# Altium schematic sheet Test_SEAx.SchDoc
size A3
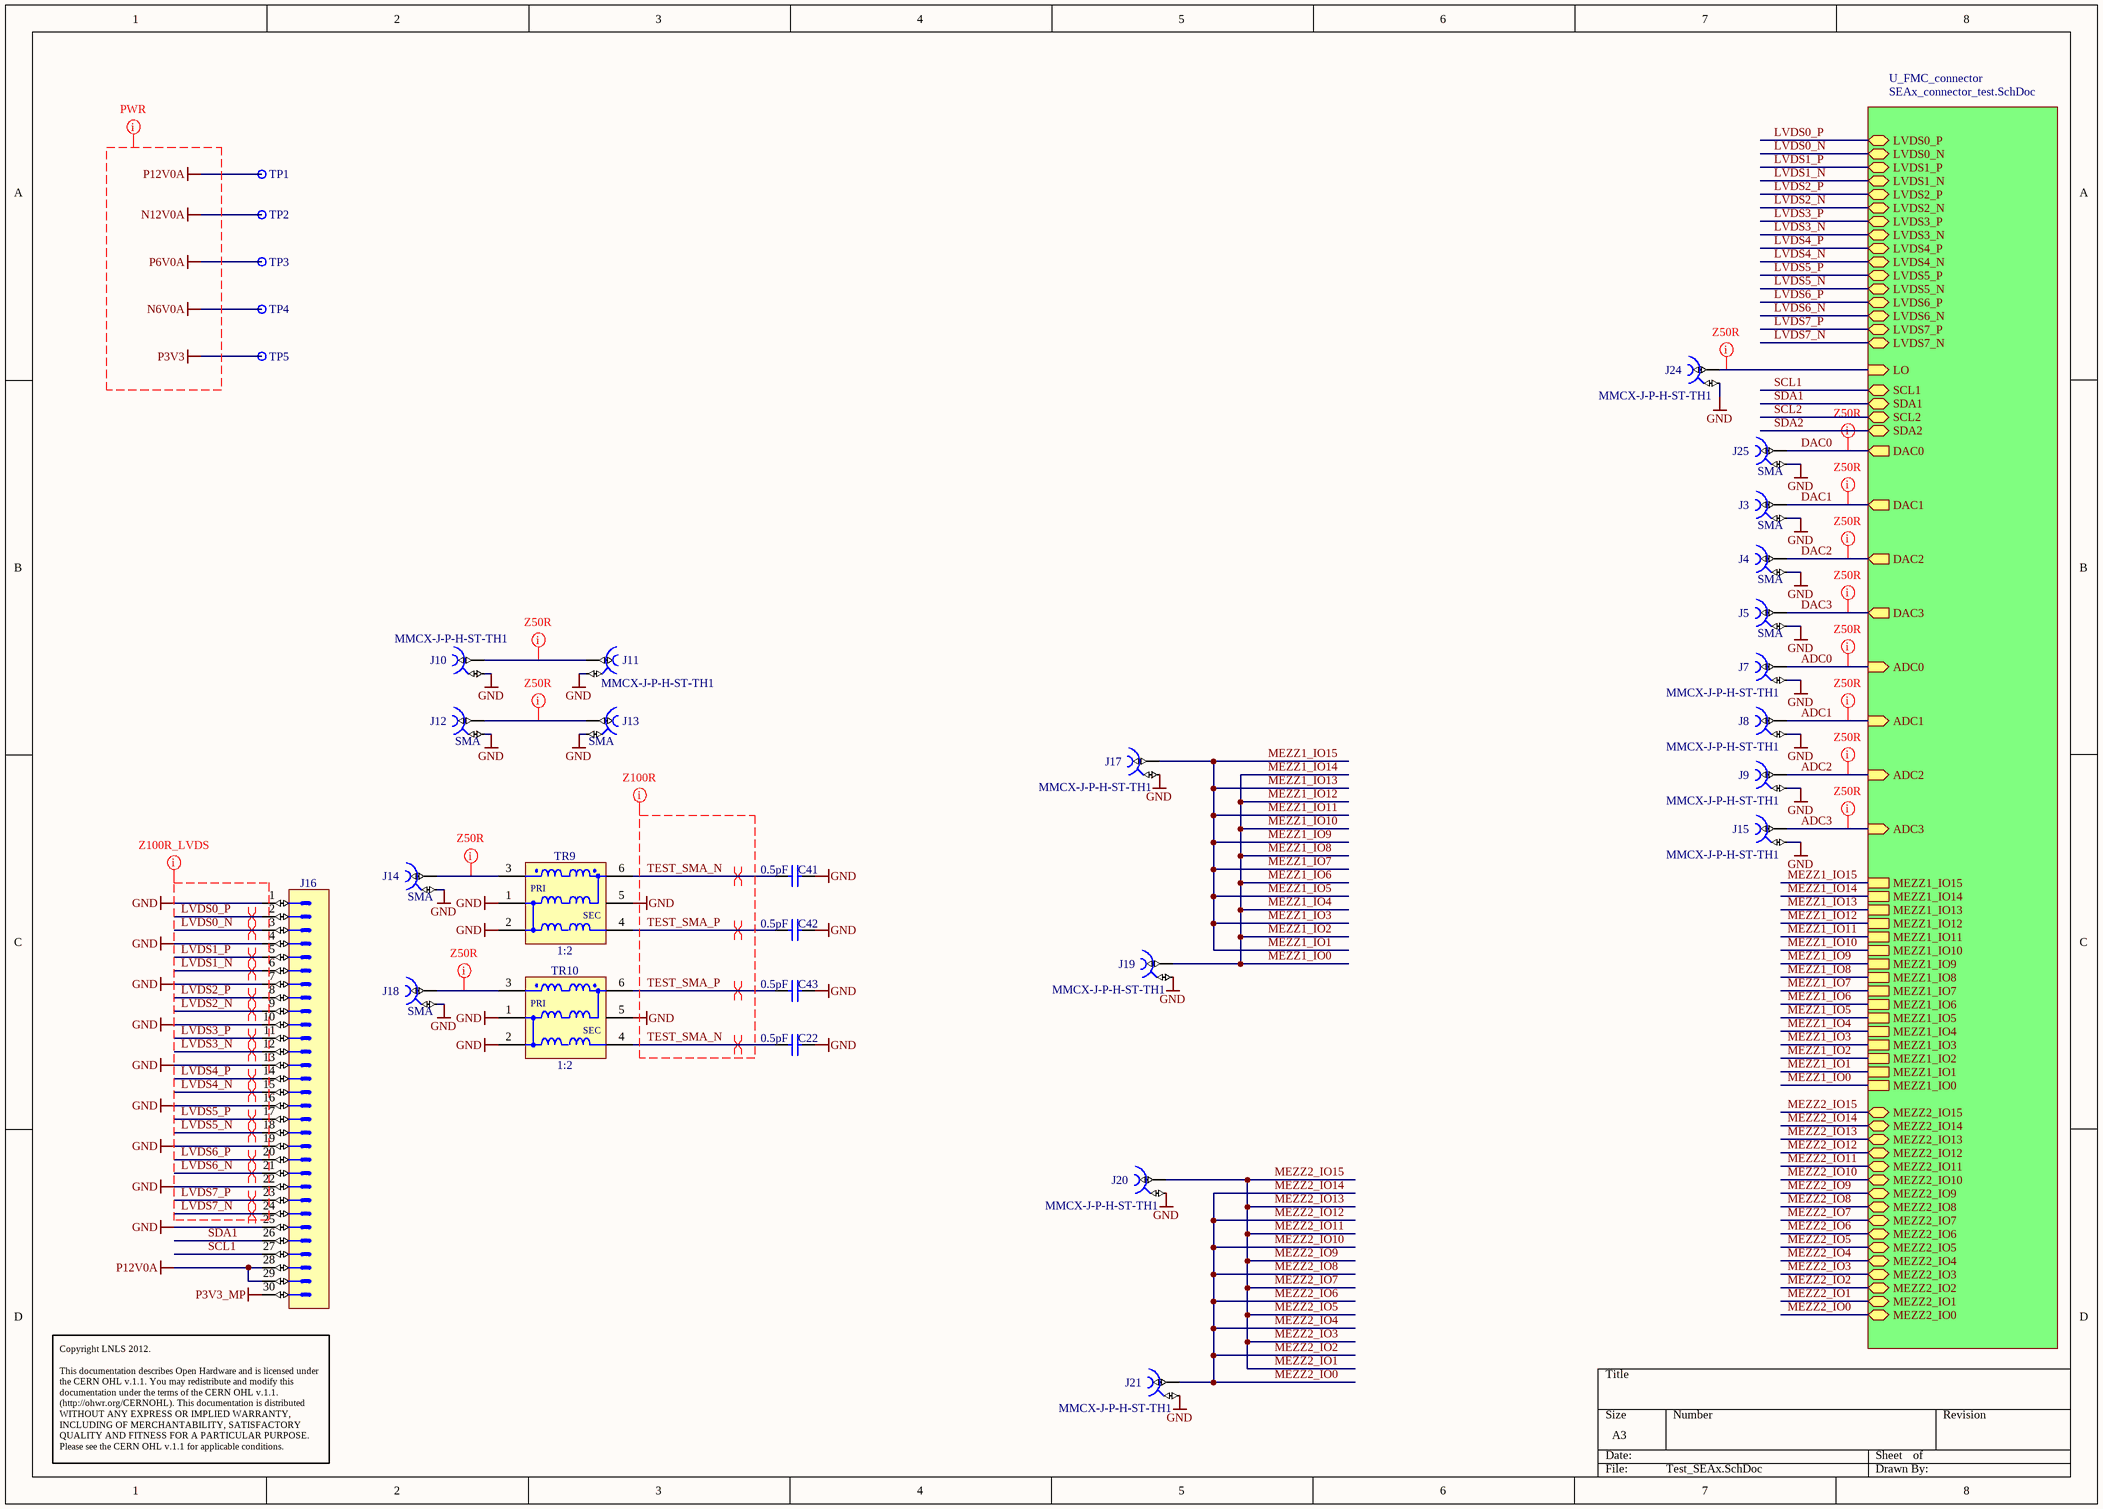
[diagram p0: Test_SEAx.SchDoc]

## Parts
C22  0.5pF  [CAPC1005X50N]
C41  0.5pF  [CAPC1005X50N]
C42  0.5pF  [CAPC1005X50N]
C43  0.5pF  [CAPC1005X50N]
J3  SMA  [TYCO_5-1814832-1]
J4  SMA  [TYCO_5-1814832-1]
J5  SMA  [TYCO_5-1814832-1]
J7  Manufacturer Part Number: MMCX-J-P-H-ST-TH1  [SAMTEC_MMCX-J-P-H-ST-TH1]  (hidden comment: Coax_1Female_1Shield)
J8  Manufacturer Part Number: MMCX-J-P-H-ST-TH1  [SAMTEC_MMCX-J-P-H-ST-TH1]  (hidden comment: Coax_1Female_1Shield)
J9  Manufacturer Part Number: MMCX-J-P-H-ST-TH1  [SAMTEC_MMCX-J-P-H-ST-TH1]  (hidden comment: Coax_1Female_1Shield)
J10  Manufacturer Part Number: MMCX-J-P-H-ST-TH1  [SAMTEC_MMCX-J-P-H-ST-TH1]  (hidden comment: Coax_1Female_1Shield)
J11  Manufacturer Part Number: MMCX-J-P-H-ST-TH1  [SAMTEC_MMCX-J-P-H-ST-TH1]  (hidden comment: Coax_1Female_1Shield)
J12  SMA  [TYCO_5-1814832-1]
J13  SMA  [TYCO_5-1814832-1]
J14  SMA  [TYCO_5-1814832-1]
J15  Manufacturer Part Number: MMCX-J-P-H-ST-TH1  [SAMTEC_MMCX-J-P-H-ST-TH1]  (hidden comment: Coax_1Female_1Shield)
J16  (no value)  [3M_N2530-6002RB]
J17  Manufacturer Part Number: MMCX-J-P-H-ST-TH1  [SAMTEC_MMCX-J-P-H-ST-TH1]  (hidden comment: Coax_1Female_1Shield)
J18  SMA  [TYCO_5-1814832-1]
J19  Manufacturer Part Number: MMCX-J-P-H-ST-TH1  [SAMTEC_MMCX-J-P-H-ST-TH1]  (hidden comment: Coax_1Female_1Shield)
J20  Manufacturer Part Number: MMCX-J-P-H-ST-TH1  [SAMTEC_MMCX-J-P-H-ST-TH1]  (hidden comment: Coax_1Female_1Shield)
J21  Manufacturer Part Number: MMCX-J-P-H-ST-TH1  [SAMTEC_MMCX-J-P-H-ST-TH1]  (hidden comment: Coax_1Female_1Shield)
J24  Manufacturer Part Number: MMCX-J-P-H-ST-TH1  [SAMTEC_MMCX-J-P-H-ST-TH1]  (hidden comment: Coax_1Female_1Shield)
J25  SMA  [TYCO_5-1814832-1]
TP1  Test Point  [TPS127]  (value not drawn)
TP2  Test Point  [TPS127]  (value not drawn)
TP3  Test Point  [TPS127]  (value not drawn)
TP4  Test Point  [TPS127]  (value not drawn)
TP5  Test Point  [TPS127]  (value not drawn)
TR9  1:2  [XFMR_MINI-CIRCUITS_DB1627]
TR10  1:2  [XFMR_MINI-CIRCUITS_DB1627]

## Sub-sheets
U_FMC_connector = SEAx_connector_test.SchDoc: ADC0 (in), ADC3 (in), ADC2 (in), ADC1 (in), MEZZ2_IO15 (bidir), MEZZ2_IO14 (bidir), MEZZ2_IO13 (bidir), MEZZ2_IO12 (bidir), MEZZ2_IO11 (bidir), MEZZ2_IO10 (bidir), MEZZ2_IO9 (bidir), MEZZ2_IO8 (bidir), MEZZ2_IO7 (bidir), MEZZ2_IO6 (bidir), MEZZ2_IO5 (bidir), MEZZ2_IO4 (bidir), MEZZ2_IO3 (bidir), MEZZ2_IO2 (bidir), MEZZ2_IO1 (bidir), MEZZ2_IO0 (bidir), MEZZ1_IO15, MEZZ1_IO14, MEZZ1_IO13, MEZZ1_IO12, MEZZ1_IO11, MEZZ1_IO10, MEZZ1_IO9, MEZZ1_IO8, MEZZ1_IO7, MEZZ1_IO6, MEZZ1_IO5, MEZZ1_IO4, MEZZ1_IO3, MEZZ1_IO2, MEZZ1_IO1, MEZZ1_IO0, SCL1 (bidir), SDA1 (bidir), SCL2 (bidir), SDA2 (bidir), LVDS0_P (bidir), LVDS0_N (bidir), LVDS1_P (bidir), LVDS1_N (bidir), LVDS2_P (bidir), LVDS2_N (bidir), LVDS3_P (bidir), LVDS3_N (bidir), LVDS4_P (bidir), LVDS4_N (bidir), LVDS5_P (bidir), LVDS5_N (bidir), LVDS6_P (bidir), LVDS6_N (bidir), LVDS7_P (bidir), LVDS7_N (bidir), LO (in), DAC0 (out), DAC3 (out), DAC2 (out), DAC1 (out)

## Nets
GND: C22.2 C41.2 C42.2 C43.2 J3.2 J4.2 J5.2 J7.2 J8.2 J9.2 J10.2 J11.2 J12.2 J13.2 J14.2 J15.2 J16.1 J16.4 J16.7 J16.10 J16.13 J16.16 J16.19 J16.22 J16.25 J17.2 J18.2 J19.2 J20.2 J21.2 J24.2 J25.2 TR9.1(P1) TR9.2(P1) TR9.5(NC) TR10.1(P1) TR10.2(P1) TR10.5(NC)
N6V0A: TP4.1
N12V0A: TP2.1
P3V3: TP5.1
P3V3_MP: J16.30
P6V0A: TP3.1
P12V0A: J16.28 J16.29 TP1.1
ADC0: J7.1 ; sheet U_FMC_connector/ADC0
ADC1: J8.1 ; sheet U_FMC_connector/ADC1
ADC2: J9.1 ; sheet U_FMC_connector/ADC2
ADC3: J15.1 ; sheet U_FMC_connector/ADC3
DAC0: J25.1 ; sheet U_FMC_connector/DAC0
DAC1: J3.1 ; sheet U_FMC_connector/DAC1
DAC2: J4.1 ; sheet U_FMC_connector/DAC2
DAC3: J5.1 ; sheet U_FMC_connector/DAC3
LVDS0_N: J16.3 ; sheet U_FMC_connector/LVDS0_N
LVDS0_P: J16.2 ; sheet U_FMC_connector/LVDS0_P
LVDS1_N: J16.6 ; sheet U_FMC_connector/LVDS1_N
LVDS1_P: J16.5 ; sheet U_FMC_connector/LVDS1_P
LVDS2_N: J16.9 ; sheet U_FMC_connector/LVDS2_N
LVDS2_P: J16.8 ; sheet U_FMC_connector/LVDS2_P
LVDS3_N: J16.12 ; sheet U_FMC_connector/LVDS3_N
LVDS3_P: J16.11 ; sheet U_FMC_connector/LVDS3_P
LVDS4_N: J16.15 ; sheet U_FMC_connector/LVDS4_N
LVDS4_P: J16.14 ; sheet U_FMC_connector/LVDS4_P
LVDS5_N: J16.18 ; sheet U_FMC_connector/LVDS5_N
LVDS5_P: J16.17 ; sheet U_FMC_connector/LVDS5_P
LVDS6_N: J16.21 ; sheet U_FMC_connector/LVDS6_N
LVDS6_P: J16.20 ; sheet U_FMC_connector/LVDS6_P
LVDS7_N: J16.24 ; sheet U_FMC_connector/LVDS7_N
LVDS7_P: J16.23 ; sheet U_FMC_connector/LVDS7_P
MEZZ1_IO0: J19.1 ; sheet U_FMC_connector/MEZZ1_IO14, sheet U_FMC_connector/MEZZ1_IO12, sheet U_FMC_connector/MEZZ1_IO10, sheet U_FMC_connector/MEZZ1_IO8, sheet U_FMC_connector/MEZZ1_IO6, sheet U_FMC_connector/MEZZ1_IO4, sheet U_FMC_connector/MEZZ1_IO2, sheet U_FMC_connector/MEZZ1_IO0  [also labelled MEZZ1_IO10, MEZZ1_IO12, MEZZ1_IO14, MEZZ1_IO2, MEZZ1_IO4, MEZZ1_IO6, MEZZ1_IO8]
MEZZ1_IO1: J17.1 ; sheet U_FMC_connector/MEZZ1_IO15, sheet U_FMC_connector/MEZZ1_IO13, sheet U_FMC_connector/MEZZ1_IO11, sheet U_FMC_connector/MEZZ1_IO9, sheet U_FMC_connector/MEZZ1_IO7, sheet U_FMC_connector/MEZZ1_IO5, sheet U_FMC_connector/MEZZ1_IO3, sheet U_FMC_connector/MEZZ1_IO1  [also labelled MEZZ1_IO11, MEZZ1_IO13, MEZZ1_IO15, MEZZ1_IO3, MEZZ1_IO5, MEZZ1_IO7, MEZZ1_IO9]
MEZZ2_IO0: J21.1 ; sheet U_FMC_connector/MEZZ2_IO14, sheet U_FMC_connector/MEZZ2_IO12, sheet U_FMC_connector/MEZZ2_IO10, sheet U_FMC_connector/MEZZ2_IO8, sheet U_FMC_connector/MEZZ2_IO6, sheet U_FMC_connector/MEZZ2_IO4, sheet U_FMC_connector/MEZZ2_IO2, sheet U_FMC_connector/MEZZ2_IO0  [also labelled MEZZ2_IO10, MEZZ2_IO12, MEZZ2_IO14, MEZZ2_IO2, MEZZ2_IO4, MEZZ2_IO6, MEZZ2_IO8]
MEZZ2_IO1: J20.1 ; sheet U_FMC_connector/MEZZ2_IO15, sheet U_FMC_connector/MEZZ2_IO13, sheet U_FMC_connector/MEZZ2_IO11, sheet U_FMC_connector/MEZZ2_IO9, sheet U_FMC_connector/MEZZ2_IO7, sheet U_FMC_connector/MEZZ2_IO5, sheet U_FMC_connector/MEZZ2_IO3, sheet U_FMC_connector/MEZZ2_IO1  [also labelled MEZZ2_IO11, MEZZ2_IO13, MEZZ2_IO15, MEZZ2_IO3, MEZZ2_IO5, MEZZ2_IO7, MEZZ2_IO9]
SCL1: J16.27 ; sheet U_FMC_connector/SCL1
SCL2: sheet U_FMC_connector/SCL2
SDA1: J16.26 ; sheet U_FMC_connector/SDA1
SDA2: sheet U_FMC_connector/SDA2
TEST_SMA_N: C22.1 C41.1 TR9.6(S1) TR10.4(S1)
TEST_SMA_P: C42.1 C43.1 TR9.4(S1) TR10.6(S1)
NetJ10_1: J10.1 J11.1
NetJ12_1: J12.1 J13.1
NetJ14_1: J14.1 TR9.3(P1)
NetJ18_1: J18.1 TR10.3(P1)
NetJ24_1: J24.1 ; sheet U_FMC_connector/LO

## Layout directives
differential pair: LVDS0_N, LVDS0_P, LVDS1_N, LVDS1_P, LVDS2_N, LVDS2_P, LVDS3_N, LVDS3_P, LVDS4_N, LVDS4_P, LVDS5_N, LVDS5_P, LVDS6_N, LVDS6_P, LVDS7_N, LVDS7_P, TEST_SMA_N, TEST_SMA_P
rule Impedance Constraint [Min = 49.00    Max = 51.00    ]; net class Z50R: ADC0, ADC1, ADC2, ADC3, DAC0, DAC1, DAC2, DAC3, NetJ10_1, NetJ12_1, NetJ14_1, NetJ18_1, NetJ24_1
rule Differential Pairs Routing [Pref Gap = 6mil    Min Gap  = 6mil    Max Gap  = 6milPref Width = 11mil    Min Width  = 11mil    Max Width  = 11mil]: GND, LVDS0_N, LVDS0_P, LVDS1_N, LVDS1_P, LVDS2_N, LVDS2_P, LVDS3_N, LVDS3_P, LVDS4_N, LVDS4_P, LVDS5_N, LVDS5_P, LVDS6_N, LVDS6_P, LVDS7_N, LVDS7_P
rule Width Constraint [Pref Width = 30mil    Min Width = 20mil    Max Width = 100mil]; net class HPWR: N6V0A, N12V0A, P3V3, P6V0A, P12V0A
rule Differential Pairs Routing [Pref Gap = 12mil    Min Gap  = 12mil    Max Gap  = 12milPref Width = 14mil    Min Width  = 14mil    Max Width  = 14mil]: TEST_SMA_N, TEST_SMA_P

## Notes on the sheet
- (near J16) Copyright LNLS 2012.
  This documentation describes Open Hardware and is licensed under the CERN OHL v.1.1. You may redistribute and modify this documentation under the terms of the CERN OHL v.1.1. (http://ohwr.org/CERNOHL). This documentation is distributed WITHOUT ANY EXPRESS OR IMPLIED WARRANTY, INCLUDING OF MERCHANTABILITY, SATISFACTORY QUALITY AND FITNESS FOR A PARTICULAR PURPOSE. Please see the CERN OHL v.1.1 for applicable conditions.
- (in symbol XFMR_MINI-CIRCUITS_TCM2-43X+) PRI; SEC

## Library data of the parts
C22 C41-C43 = CC0402_0.5PF_25V_0.05PF_AVX_04023J0R5ABSTR: Non-polarised capacitor; Part Description: Thin-Film Chip Capacitors for RF Signal and Power Applications, Accu-P Series; Manufacturer: AVX; Voltage: 25V; Tolerance: ±0.05pF; Part Number: CC0402_0.5PF_25V_0.05PF_AVX_04023J0R5ABSTR; Component Kind: Standard; Component Type: Standard; Pin Count: 2; Value: 0.5pF; Status: None; Manufacturer Part Number: 04023J0R5ABSTR; Case: 0402; Mounted: Yes; Socket: No; SMD: Yes; Sense: No; ComponentHeight: 0.5mm; HelpURL: \\cern.ch\dfs\Applications\Altium\Datasheets\CC0402_AVX_ACCU-P.pdf; Author: CERN DEM JLC; CreateDate: 22.02.2017; LatestRevisionDate: 22.02.2017
J3-J5 J12-J14 J18 J25 = TYCO_5-1814832-1: Part Description: 50 Ohms SMA Straight PCB Die Socket; Manufacturer: TYCO ELECTRONICS; PressFit: No; Part Number: TYCO_5-1814832-1; Component Kind: Standard; Component Type: Standard; Pin Count: 2; Family: SMA; Mounted: Yes; Socket: No; SMD: No; Sense: No; Status: None; Manufacturer Part Number: 5-1814832-1; ComponentHeight: 13.5mm; HelpURL: \\cern.ch\dfs\Applications\Altium\Datasheets\TYCO_5-1814832-1.pdf; Author: CERN DEM JLC; CreateDate: 17.11.2009; LatestRevisionDate: 17.11.2009
J7-J11 J15 J17 J19-J21 J24 = SAMTEC_MMCX-J-P-H-ST-TH1: Part Description: Straight Through-hole 50 Ohm Micro Mini RF Jack, MMCX Series; Manufacturer: SAMTEC; PressFit: No; Part Number: SAMTEC_MMCX-J-P-H-ST-TH1; Component Kind: Standard; Component Type: Standard; Pin Count: 2; Mounted: Yes; Socket: No; Sense: No; SMD: No; Status: None; ComponentHeight: 4.35mm; HelpURL: \\cern.ch\dfs\Applications\Altium\Datasheets\SAMTEC_MMCX-J-P-H-ST-TH1.pdf; Author: CERN DEM JLC; CreateDate: 05.12.2012; LatestRevisionDate: 05.12.2012
J16 = 3M_N2530-6002RB: Connector 30 Male; Part Description: 30 Contacts - Straight .100'' x .100'' Low Profile Four-Wall Header, 2500 Series; Manufacturer: 3M; PressFit: No; Part Number: 3M_N2530-6002RB; Component Kind: Standard; Component Type: Standard; Pin Count: 30; Family: Header 30; Mounted: Yes; Socket: No; SMD: No; Sense: No; Status: None; Manufacturer Part Number: N2530-6002RB; ComponentHeight: 10.03mm; HelpURL: \\cern.ch\dfs\Applications\Altium\Datasheets\3M_N2530-6002RB.pdf; Author: CERN DEM JLC; CreateDate: 11.02.2009; LatestRevisionDate: 11.08.2009
TP1-TP5 = SMD_PAD_1.27X1.27MM: Part Description: 1.27mm x 1.27mm PCB Copper Area (SMD Test Point); Mounted: No; Part Number: SMD_PAD_1.27X1.27MM; Component Kind: Standard (No BOM); Component Type: Standard (No BOM); Pin Count: 1; Family: Test Point; Socket: No; SMD: Yes; Sense: No; Status: None; ComponentHeight: 0mm; HelpURL: Undefined; Author: CERN DEM JLC; CreateDate: 12.01.2008; LatestRevisionDate: 12.01.2008; PackageDescription: 1.27mm x 1.27mm PCB Copper Area (SMD Test Point)
TR9 TR10 = XFMR_MINI-CIRCUITS_TCM2-43X+: 50 OHMS 10 to 4000 MHz RF Transformer; Power: 0.4W; Part Number: XFMR_MINI-CIRCUITS_TCM2-43X+; Component Kind: Standard; Component Type: Standard; Pin Count: 6; Value: 1:2; Status: None; Part Description: 50 Ohms 10 to 4000MHz RF Transformer; Manufacturer: MINI-CIRCUITS; Manufacturer Part Number: TCM2-43X+; Mounted: Yes; Socket: No; Sense: No; SMD: Yes; ComponentHeight: 4.06mm; HelpURL: \\cern.ch\dfs\Applications\Altium\Datasheets\XFMR_MINI-CIRCUITS_TCM2-43X+.pdf; Author: CERN DEM BC; CreateDate: 12.02.2016; LatestRevisionDate: 12.02.2016